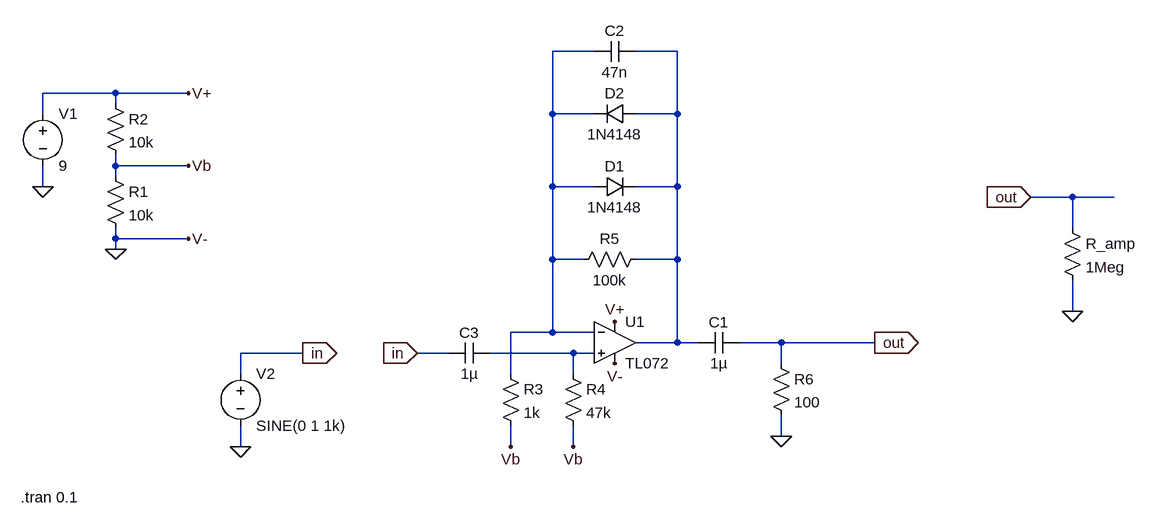
[diagram p0: schematic OD1.asc]
OD1.asc, the LTspice schematic file:
Version 4
SHEET 1 1352 680
WIRE 512 -112 448 -112
WIRE 640 -112 576 -112
WIRE -224 -48 -336 -48
WIRE -112 -48 -224 -48
WIRE -224 -32 -224 -48
WIRE -336 -16 -336 -48
WIRE 448 -16 448 -112
WIRE 512 -16 448 -16
WIRE 640 -16 640 -112
WIRE 640 -16 576 -16
WIRE -224 64 -224 48
WIRE -112 64 -224 64
WIRE -224 80 -224 64
WIRE -336 96 -336 64
WIRE 448 96 448 -16
WIRE 512 96 448 96
WIRE 640 96 640 -16
WIRE 640 96 576 96
WIRE 1248 112 1184 112
WIRE 1312 112 1248 112
WIRE 1248 160 1248 112
WIRE -224 176 -224 160
WIRE -112 176 -224 176
WIRE -224 192 -224 176
WIRE 448 208 448 96
WIRE 496 208 448 208
WIRE 640 208 640 96
WIRE 640 208 576 208
WIRE 1248 288 1248 240
WIRE 448 320 448 208
WIRE 448 320 384 320
WIRE 512 320 448 320
WIRE 640 336 640 208
WIRE 640 336 576 336
WIRE 672 336 640 336
WIRE 800 336 736 336
WIRE 944 336 800 336
WIRE 64 352 -32 352
WIRE 288 352 240 352
WIRE 480 352 352 352
WIRE 512 352 480 352
WIRE 800 368 800 336
WIRE -32 384 -32 352
WIRE 384 384 384 320
WIRE 480 384 480 352
WIRE 800 480 800 448
WIRE -32 496 -32 464
WIRE 384 496 384 464
WIRE 480 496 480 464
FLAG 240 352 in
IOPIN 240 352 In
FLAG 944 336 out
IOPIN 944 336 Out
FLAG 64 352 in
IOPIN 64 352 Out
FLAG 1184 112 out
IOPIN 1184 112 In
FLAG -32 496 0
FLAG 1248 288 0
FLAG -224 192 0
FLAG -112 -48 V+
FLAG -112 176 V-
FLAG -112 64 Vb
FLAG -336 96 0
FLAG 544 304 V+
FLAG 544 368 V-
FLAG 384 496 Vb
FLAG 480 496 Vb
FLAG 800 480 0
SYMBOL voltage -336 -32 R0
WINDOW 123 0 0 Left 0
WINDOW 39 0 0 Left 0
SYMATTR InstName V1
SYMATTR Value 9
SYMBOL voltage -32 368 R0
WINDOW 123 0 0 Left 0
WINDOW 39 0 0 Left 0
SYMATTR InstName V2
SYMATTR Value SINE(0 1 1k)
SYMBOL res 1232 144 R0
SYMATTR InstName R_amp
SYMATTR Value 1Meg
SYMBOL res -240 64 R0
SYMATTR InstName R1
SYMATTR Value 10k
SYMBOL res -240 -48 R0
SYMATTR InstName R2
SYMATTR Value 10k
SYMBOL TL072 544 272 R0
SYMATTR InstName U1
SYMBOL res 368 368 R0
SYMATTR InstName R3
SYMATTR Value 1k
SYMBOL res 464 368 R0
SYMATTR InstName R4
SYMATTR Value 47k
SYMBOL diode 512 112 R270
WINDOW 0 32 32 VTop 2
WINDOW 3 0 32 VBottom 2
SYMATTR InstName D1
SYMATTR Value 1N4148
SYMBOL diode 576 -32 R90
WINDOW 0 0 32 VBottom 2
WINDOW 3 32 32 VTop 2
SYMATTR InstName D2
SYMATTR Value 1N4148
SYMBOL res 592 192 R90
WINDOW 0 0 56 VBottom 2
WINDOW 3 32 56 VTop 2
SYMATTR InstName R5
SYMATTR Value 100k
SYMBOL cap 736 320 R90
WINDOW 0 0 32 VBottom 2
WINDOW 3 32 32 VTop 2
SYMATTR InstName C1
SYMATTR Value 1µ
SYMBOL cap 576 -128 R90
WINDOW 0 0 32 VBottom 2
WINDOW 3 32 32 VTop 2
SYMATTR InstName C2
SYMATTR Value 47n
SYMBOL cap 352 336 R90
WINDOW 0 0 32 VBottom 2
WINDOW 3 32 32 VTop 2
SYMATTR InstName C3
SYMATTR Value 1µ
SYMBOL res 784 352 R0
SYMATTR InstName R6
SYMATTR Value 100
TEXT -370 574 Left 2 !.tran 0.1

The netlist it stands for:
* OD1.asc
V1 V+ 0 9
V2 in 0 SINE(0 1 1k)
R_amp out 0 1Meg
R1 Vb 0 10k
R2 V+ Vb 10k
* U1: TL072 (symbol TL072 not available, pins judged from their places): In+=N003 In-=N001 V+=V+ V-=0 OUT=N002
R3 N001 Vb 1k
R4 N003 Vb 47k
D1 N001 N002 1N4148
D2 N002 N001 1N4148
R5 N002 N001 100k
C1 out N002 1µ
C2 N002 N001 47n
C3 N003 in 1µ
R6 out 0 100
.model D D
.lib standard.dio
.tran 0.1
.backanno
.end